# Altium schematic sheet 0 - Title.SchDoc
size A4
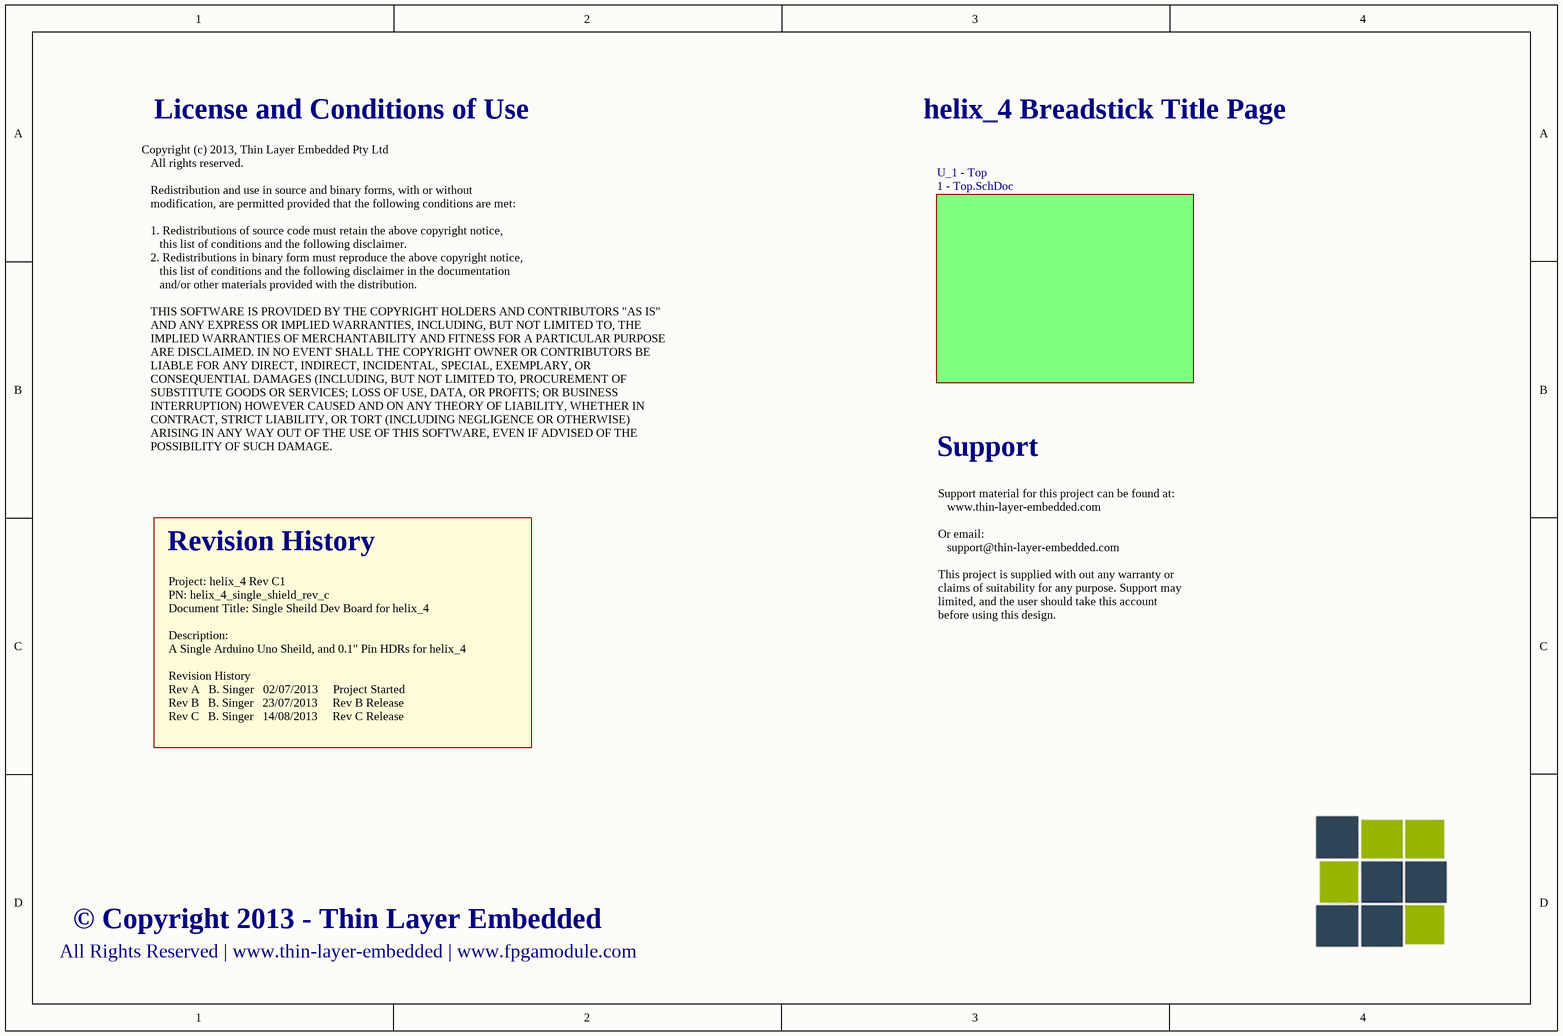
[diagram p0: 0 - Title.SchDoc]

## Sub-sheets
U_1 - Top = 1 - Top.SchDoc: no entries

## Notes on the sheet
- License and Conditions of Use
- helix_4 Breadstick Title Page
- Copyright (c) 2013, Thin Layer Embedded Pty Ltd
  All rights reserved.
  Redistribution and use in source and binary forms, with or without
  modification, are permitted provided that the following conditions are met:
  1. Redistributions of source code must retain the above copyright notice,
  this list of conditions and the following disclaimer.
  2. Redistributions in binary form must reproduce the above copyright notice,
  this list of conditions and the following disclaimer in the documentation
  and/or other materials provided with the distribution.
  THIS SOFTWARE IS PROVIDED BY THE COPYRIGHT HOLDERS AND CONTRIBUTORS "AS IS"
  AND ANY EXPRESS OR IMPLIED WARRANTIES, INCLUDING, BUT NOT LIMITED TO, THE
  IMPLIED WARRANTIES OF MERCHANTABILITY AND FITNESS FOR A PARTICULAR PURPOSE
  ARE DISCLAIMED. IN NO EVENT SHALL THE COPYRIGHT OWNER OR CONTRIBUTORS BE
  LIABLE FOR ANY DIRECT, INDIRECT, INCIDENTAL, SPECIAL, EXEMPLARY, OR
  CONSEQUENTIAL DAMAGES (INCLUDING, BUT NOT LIMITED TO, PROCUREMENT OF
  SUBSTITUTE GOODS OR SERVICES; LOSS OF USE, DATA, OR PROFITS; OR BUSINESS
  INTERRUPTION) HOWEVER CAUSED AND ON ANY THEORY OF LIABILITY, WHETHER IN
  CONTRACT, STRICT LIABILITY, OR TORT (INCLUDING NEGLIGENCE OR OTHERWISE)
  ARISING IN ANY WAY OUT OF THE USE OF THIS SOFTWARE, EVEN IF ADVISED OF THE
  POSSIBILITY OF SUCH DAMAGE.
- Support
- Revision History
- Support material for this project can be found at:
  www.thin-layer-embedded.com
  Or email:
  support@thin-layer-embedded.com
  This project is supplied with out any warranty or
  claims of suitability for any purpose. Support may
  limited, and the user should take this account
  before using this design.
- Project: helix_4 Rev C1
  PN: helix_4_single_shield_rev_c
  Document Title: Single Sheild Dev Board for helix_4
  Description:
  A Single Arduino Uno Sheild, and 0.1" Pin HDRs for helix_4
  Revision History
  Rev A   B. Singer   02/07/2013     Project Started
  Rev B   B. Singer   23/07/2013     Rev B Release
  Rev C   B. Singer   14/08/2013     Rev C Release
- All Rights Reserved | www.thin-layer-embedded | www.fpgamodule.com
- © Copyright 2013 - Thin Layer Embedded